# EAGLE design HW2_latest (EAGLE 7.5.0)
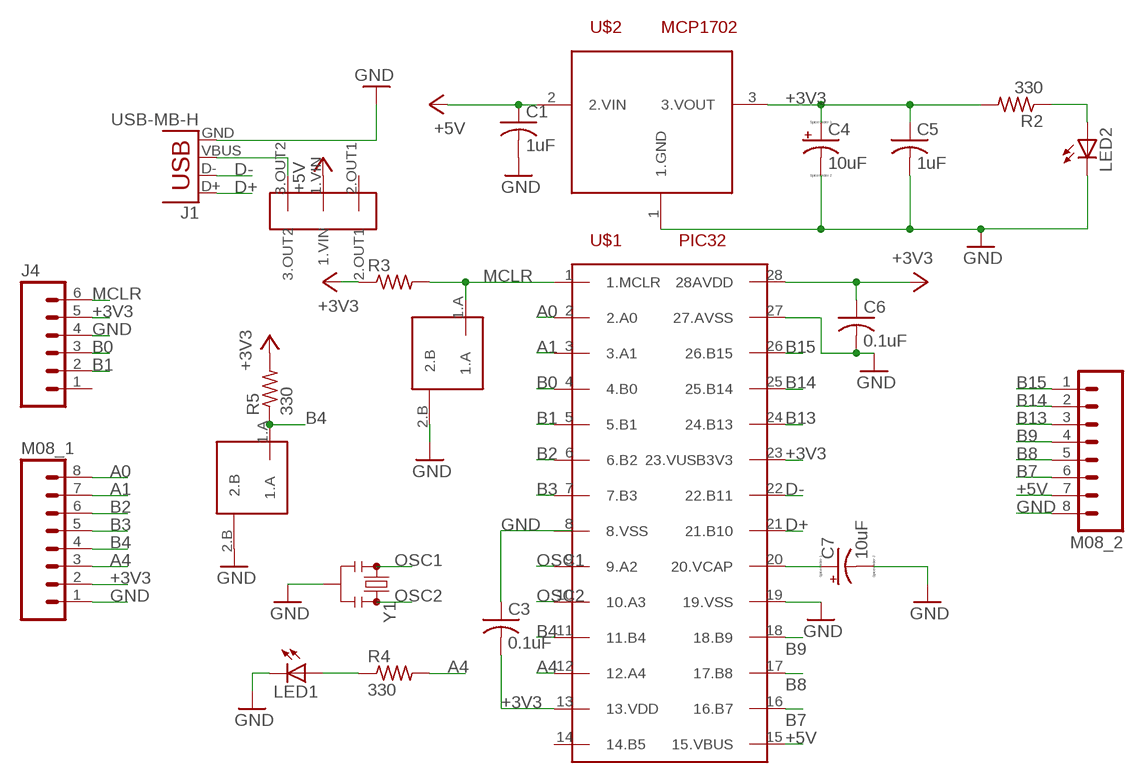
[diagram p0: schematic, sheet 1]

## Parts
C1  1uF  C-US025-024X044  [C025-024X044]
C3  0.1uF  C-US025-024X044  [C025-024X044]
C4  10uF  CPOL-USTT2D4  [TT2D4]
C5  1uF  C-US025-024X044  [C025-024X044]
C6  0.1uF  C-US025-024X044  [C025-024X044]
C7  10uF  CPOL-USTT2D4  [TT2D4]
J1  USB-MB-H  [USB-MB-H]
J4  M06SILK_FEMALE_PTH  [1X06]
LED1  LED3MM  [LED3MM]
LED2  LED3MM  [LED3MM]
M08_1  M08  [1X08_ROUND]
M08_2  M08  [1X08_ROUND]
R2  330  R-US_0207/10  [0207/10]
R3  R-US_0207/10  [0207/10]
R4  330  R-US_0207/10  [0207/10]
R5  330  R-US_0207/10  [0207/10]
U$1  PIC32  [DIL28-3]
U$2  MCP1702  [TO92]
U$3  SLIDE_SWITCH  [SLIDE_SWITCH]
U$4  PUSH_BUTTON  [PUSH_BUTTON]
U$5  PUSH_BUTTON  [PUSH_BUTTON]
Y1  RESONATORPTH  [RESONATOR-PTH]

## Nets
+3V3: C3.2 C4.+ C5.1 C6.1 J4.5 M08_1.2 R2.2 R3.1 R5.2 U$1.13(13.VDD) U$1.23(23.VUSB3V3) U$1.28(28AVDD) U$2.3(3.VOUT)
+5V: C1.1 M08_2.7 U$1.15(15.VBUS) U$2.2(2.VIN) U$3.1.VIN
A0: M08_1.8 U$1.2(2.A0)
A1: M08_1.7 U$1.3(3.A1)
A4: M08_1.3 R4.2 U$1.12(12.A4)
B0: J4.3 U$1.4(4.B0)
B1: J4.2 U$1.5(5.B1)
B2: M08_1.6 U$1.6(6.B2)
B3: M08_1.5 U$1.7(7.B3)
B4: M08_1.4 R5.1 U$1.11(11.B4) U$5.1.A
B7: M08_2.6 U$1.16(16.B7)
B8: M08_2.5 U$1.17(17.B8)
B9: M08_2.4 U$1.18(18.B9)
B13: M08_2.3 U$1.24(24.B13)
B14: M08_2.2 U$1.25(25.B14)
B15: M08_2.1 U$1.26(26.B15)
D+: J1.D+ U$1.21(21.B10)
D-: J1.D- U$1.22(22.B11)
GND: C1.2 C3.1 C4.- C5.2 C6.2 C7.- J1.GND J4.4 LED1.K(C) LED2.K(C) M08_1.1 M08_2.8 U$1.19(19.VSS) U$1.27(27.AVSS) U$2.1(1.GND) U$4.2.B U$5.2.B Y1.2
MCLR: J4.6 R3.2 U$1.1(1.MCLR) U$4.1.A
N$1: LED1.A R4.1
N$2: LED2.A R2.1
N$3: J1.VBUS U$3.3.OUT2
N$4: C7.+ U$1.20(20.VCAP)
OSC1: U$1.9(9.A2) Y1.1
OSC2: U$1.10(10.A3) Y1.3
Unconnected: J4.1 U$1.8(8.VSS) U$1.14(14.B5) U$3.2.OUT1

## Library data of the parts
C1 C3 C5 C6 = PIC32:C-US: CAPACITOR, American symbol
C4 C7 = PIC32:CPOL-US: POLARIZED CAPACITOR, American symbol
J1 = PIC32:USB: USB Connectors USB-B-PTH is fully proven SKU : PRT-00139/CONN-08278 USB-miniB is fully proven SKU : PRT-00587 USB-A-PCB is untested. USB-A-H is throughly reviewed, but untested. Spark Fun Electronics SKU : PRT-00437 USB-B-SMT is throughly reviewed, but untested. Needs silkscreen touching up. USB-A-S has not been used/tested USB-MB-H has not been used/tested USB-MICROB has been used. CONN-09505
J4 = PIC32:M06: Header 6 Standard 6-pin 0.1" header. Use with straight break away headers (SKU : PRT-00116), right angle break away headers (PRT-00553), swiss pins (PRT-00743), machine pins (PRT-00117), and female headers (PRT-00115). Molex polarized connector foot print use with SKU : PRT-08094 with associated crimp pins and housings. NOTES ON THE VARIANTS LOCK and LOCK_LONGPADS... This footprint was designed to help hold the alignment of a through-hole component (i.e. 6-pin header) while soldering it into place. You may notice that each hole has been shifted either up or down by 0.005 of an inch from it's more standard position (which is a perfectly straight line). This slight alteration caused the pins (the squares in the middle) to touch the edges of the holes. Because they are alternating, it causes a "brace" to hold the component in place. 0.005 has proven to be the perfect amount of "off-center" position when using our standard breakaway headers. Although looks a little odd when you look at the bare footprint, once you have a header in there, the alteration is very hard to notice. Also,if you push a header all the way into place, it is covered up entirely on the bottom side. This idea of altering the position of holes to aid alignment will be further integrated into the Sparkfun Library for other footprints. It can help hold any component with 3 or more connection pins.; PROD_ID: CONN-08437
LED1 LED2 = PIC32:LED: LED OSRAM: - CHIPLED LG R971, LG N971, LY N971, LG Q971, LY Q971, LO R971, LY R971 LH N974, LH R974 LS Q976, LO Q976, LY Q976 LO Q996 - Hyper CHIPLED LW Q18S LB Q993, LB Q99A, LB R99A - SideLED LS A670, LO A670, LY A670, LG A670, LP A670 LB A673, LV A673, LT A673, LW A673 LH A674 LY A675 LS A676, LA A676, LO A676, LY A676, LW A676 LS A679, LY A679, LG A679 - Hyper Micro SIDELED® LS Y876, LA Y876, LO Y876, LY Y876 LT Y87S - SmartLED LW L88C, LW L88S LB L89C, LB L89S, LG L890 LS L89K, LO L89K, LY L89K LS L896, LA L896, LO L896, LY L896 - TOPLED LS T670, LO T670, LY T670, LG T670, LP T670 LSG T670, LSP T670, LSY T670, LOP T670, LYG T670 LG T671, LOG T671, LSG T671 LB T673, LV T673, LT T673, LW T673 LH T674 LS T676, LA T676, LO T676, LY T676, LB T676, LH T676, LSB T676, LW T676 LB T67C, LV T67C, LT T67C, LS T67K, LO T67K, LY T67K, LW E67C LS E67B, LA E67B, LO E67B, LY E67B, LB E67C, LV E67C, LT E67C LW T67C LS T679, LY T679, LG T679 LS T770, LO T770, LY T770, LG T770, LP T770 LB T773, LV T773, LT T773, LW T773 LH T774 LS E675, LA E675, LY E675, LS T675 LS T776, LA T776, LO T776, LY T776, LB T776 LHGB T686 LT T68C, LB T68C - Hyper Mini TOPLED® LB M676 - Mini TOPLED Santana® LG M470 LS M47K, LO M47K, LY M47K Source: http://www.osram.convergy.de LUXEON: - LUMILED® LXK2-PW12-R00, LXK2-PW12-S00, LXK2-PW14-U00, LXK2-PW14-V00 LXK2-PM12-R00, LXK2-PM12-S00, LXK2-PM14-U00 LXK2-PE12-Q00, LXK2-PE12-R00, LXK2-PE12-S00, LXK2-PE14-T00, LXK2-PE14-U00 LXK2-PB12-K00, LXK2-PB12-L00, LXK2-PB12-M00, LXK2-PB14-N00, LXK2-PB14-P00, LXK2-PB14-Q00 LXK2-PR12-L00, LXK2-PR12-M00, LXK2-PR14-Q00, LXK2-PR14-R00 LXK2-PD12-Q00, LXK2-PD12-R00, LXK2-PD12-S00 LXK2-PH12-R00, LXK2-PH12-S00 LXK2-PL12-P00, LXK2-PL12-Q00, LXK2-PL12-R00 Source: www.luxeon.com KINGBRIGHT: KA-3528ASYC Source: www.kingbright.com
M08_1 M08_2 = PIC32:M08: Header 8 Standard 8-pin 0.1" header. Use with straight break away headers (SKU : PRT-00116), right angle break away headers (PRT-00553), swiss pins (PRT-00743), machine pins (PRT-00117), and female headers (PRT-00115).; PROD_ID: CONN-08437
R2-R5 = PIC32:R-US_: RESISTOR, American symbol
U$1 = PIC32:PIC32
U$2 = PIC32:MCP1702
U$3 = PIC32:SLIDE_SWITCH
U$4 U$5 = PIC32:PUSH_BUTTON
Y1 = PIC32:RESONATOR: Resonator Small SMD resonator. Used, eg, on the Arduino Pro/ Pro Mini boards. 8MHz- XTAL-08895 16MHz- XTAL-08900

## Board
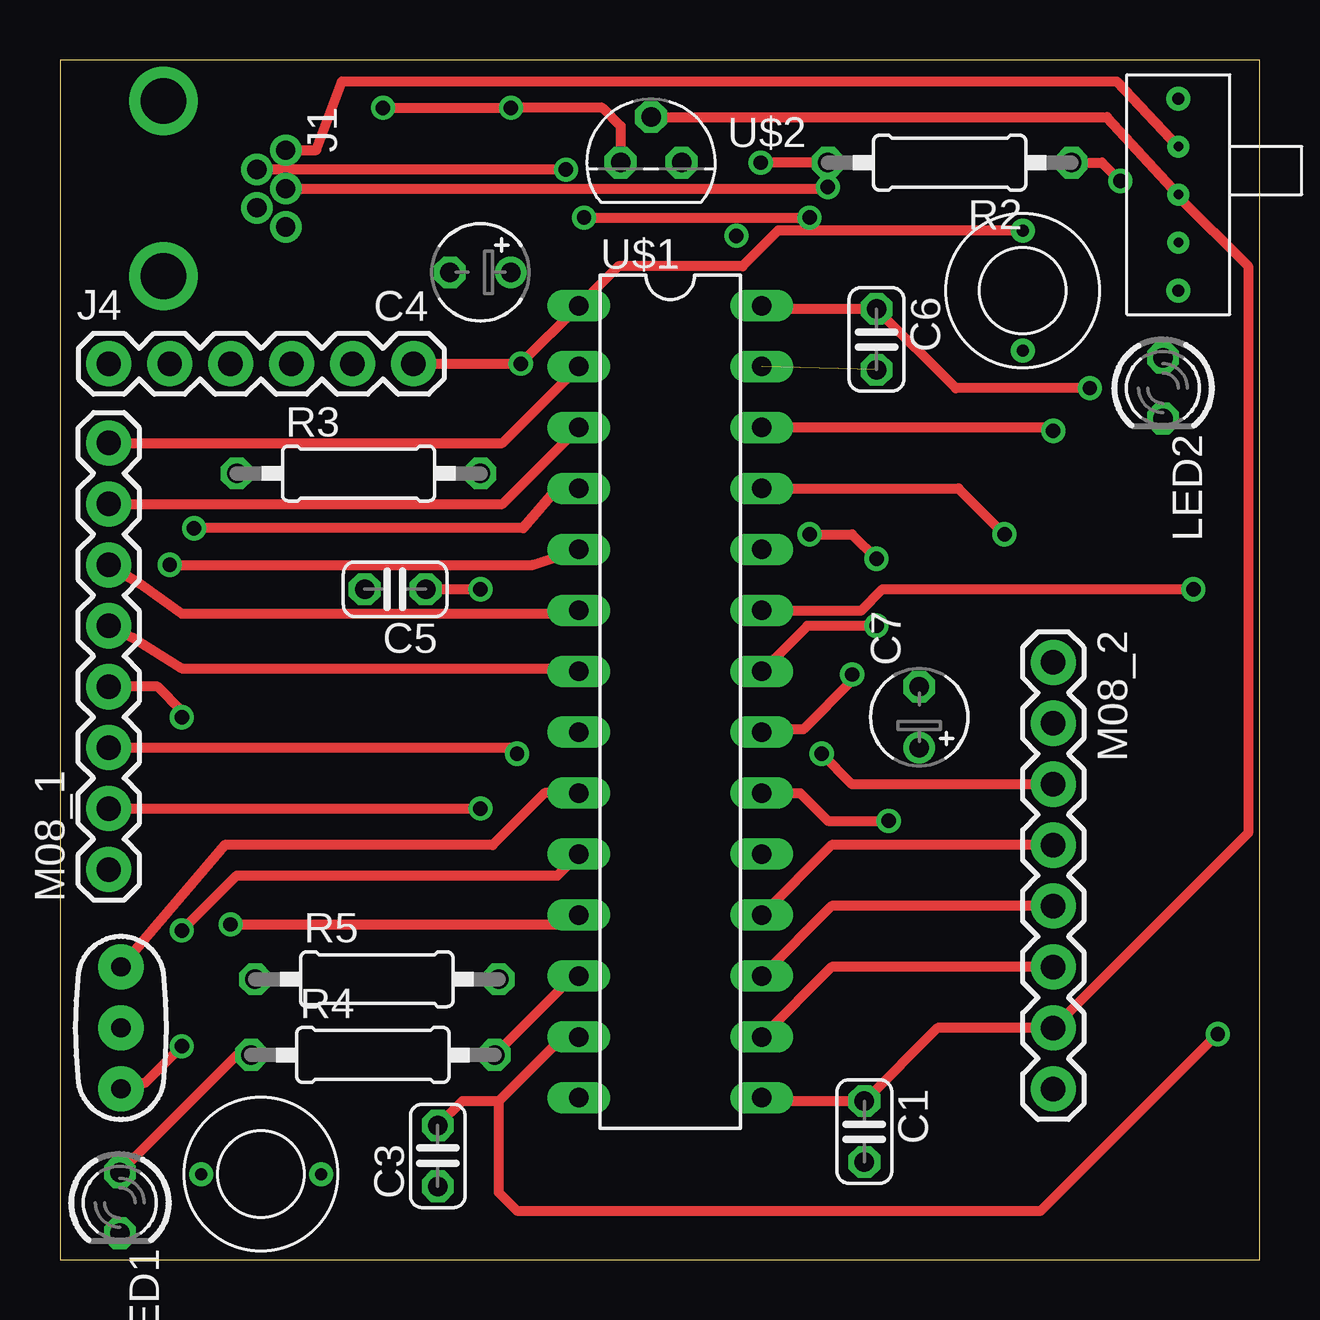
[diagram p1: board, top side]
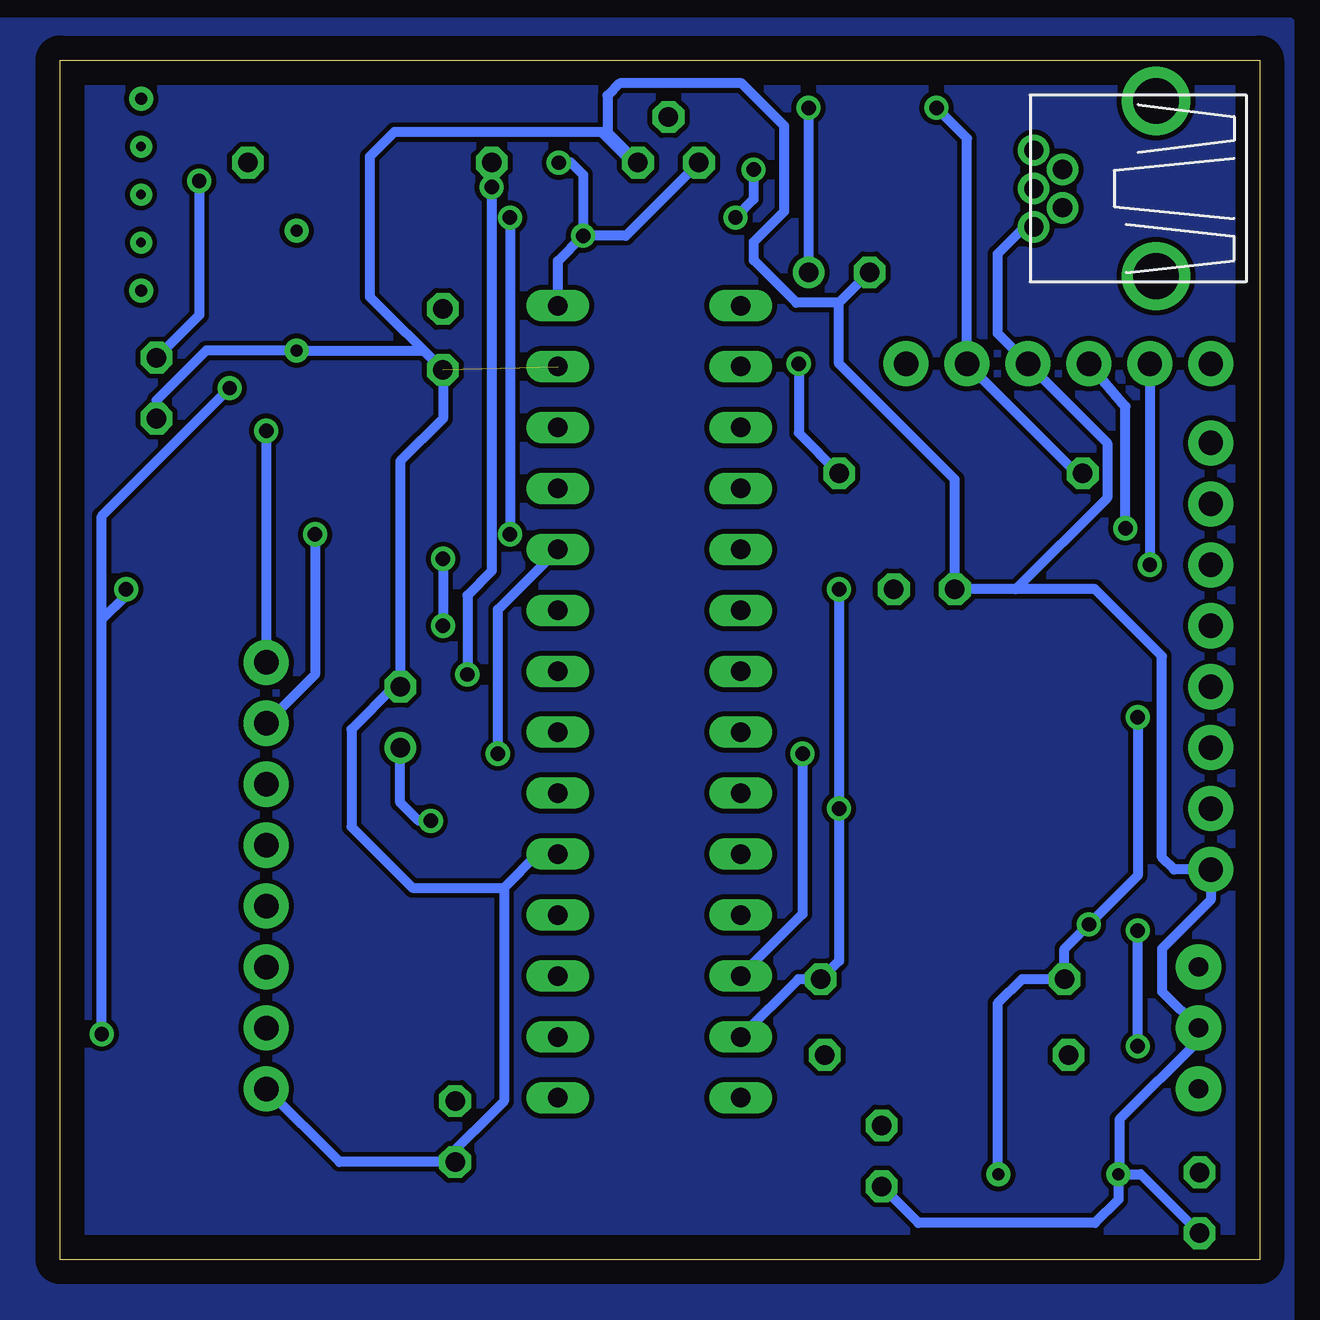
[diagram p2: board, bottom side, seen from below]

Size 50 x 50 mm. Coordinates in mm from the lower left corner, seen from the top.
Outline: 0,0 50,0 50,50 0,50 0,0
Copper layers (1*16): Top 0.035mm / dielectric 1.5mm / Bottom 0.035mm
Design rules "default": minimum track width 10mil, minimum drill 24mil, track to track 8mil, track to pad 8mil, pad to pad 8mil, via to via 8mil, smd to smd 8mil, copper to edge 40mil, drill to drill 8mil, minimum pad ring 10mil, minimum via ring 8mil, stop-mask expansion 4mil, vias tented up to drill 0mil, thermal gap 10mil

### Footprints (pad centres in the part's own frame; a part is rotated, then mirrored left to right if it is on the bottom)
C025-024X044 = drill 0.813 octagon: 1 -1.27,0; 2 1.27,0
TT2D4 = drill 0.813: + -1.27,0 | drill 0.813 octagon: - 1.27,0
USB-MB-H = drill 0.8: D+ 5.1,0; D- 3.9,0.8; GND 5.1,-1.6; ID 3.9,-0.8; VBUS 5.1,1.6 | drill 1.9: P$6 0,-3.65; P$7 0,3.65
1X06 = drill 1.016 pad 1.88: 1 0,0; 2 2.54,0; 3 5.08,0; 4 7.62,0; 5 10.16,0; 6 12.7,0
LED3MM = drill 0.813 octagon: A -1.27,0; K 1.27,0
1X08_ROUND = drill 1.016 pad 1.88: 1 0,0; 2 2.54,0; 3 5.08,0; 4 7.62,0; 5 10.16,0; 6 12.7,0; 7 15.24,0; 8 17.78,0
0207/10 = drill 0.813 octagon: 1 -5.08,0; 2 5.08,0
DIL28-3 = drill 0.813 long: 1 -16.51,-3.81; 2 -13.97,-3.81; 3 -11.43,-3.81; 4 -8.89,-3.81; 5 -6.35,-3.81; 6 -3.81,-3.81; 7 -1.27,-3.81; 8 1.27,-3.81; 9 3.81,-3.81; 10 6.35,-3.81; 11 8.89,-3.81; 12 11.43,-3.81; 13 13.97,-3.81; 14 16.51,-3.81; 15 16.51,3.81; 16 13.97,3.81; 17 11.43,3.81; 18 8.89,3.81; 19 6.35,3.81; 20 3.81,3.81; 21 1.27,3.81; 22 -1.27,3.81; 23 -3.81,3.81; 24 -6.35,3.81; 25 -8.89,3.81; 26 -11.43,3.81; 27 -13.97,3.81; 28 -16.51,3.81
TO92 = drill 0.813 octagon: 1 1.27,0; 2 0,1.905; 3 -1.27,0
SLIDE_SWITCH = drill 0.4: 1.VIN 0,0; 2.OUT1 -2,0; 3.OUT2 2,0 | drill 0.5: 4.X -4,0; 5.X 4,0
PUSH_BUTTON = drill 0.5: 1.A -2.5,0; 2.B 2.5,0
RESONATOR-PTH = drill 0.8 pad 1.88: 1 -2.54,0; 2 0,0; 3 2.54,0

### Placement (x,y rotation side)
C1  33.53,5.33 270 top
C3  15.75,4.32 90 top
C4  17.53,41.15 180 top
C5  13.97,27.94 180 top
C6  34.04,38.35 270 top
C7  35.81,22.61 90 top
J1  4.31,44.64 0 top
J4  2.03,37.34 0 top
LED1  2.49,2.36 270 top
LED2  45.97,36.32 270 top
M08_1  2.03,16.26 90 top
M08_2  41.4,24.89 270 top
R2  37.08,45.72 180 top
R3  12.45,32.77 0 top
R4  13.04,8.53 0 top
R5  13.21,11.68 0 top
U$1  25.44,23.25 270 top
U$2  24.64,45.72 0 top
U$3  46.62,44.39 90 top
U$4  40.13,40.39 270 top
U$5  8.38,3.56 180 top
Y1  2.54,9.65 270 top

### Tracks (layer width: path | path; a pad name or v marks a point on that pad's centre or on a via)
+3V3  (via drill 0.6)
  Top 0.406: U$1.28 29.39,39.62 C6.1 37.34,36.32 v42.93,36.32 | R2.2 v29.21,45.72 | v13.46,48.01 v18.8,48.01 22.61,48.01 23.37,47.24 U$2.3 | U$1.13 20.96,9.28 18.29,6.6 | 18.29,6.6 18.29,2.79 19.05,2.03 40.89,2.03 v48.26,9.4 | 18.29,6.6 16.76,6.6 C3.2 | 4.06,18.8 M08_1.2 v17.53,18.8 | C5.1 v17.53,27.94 | U$1.23 33.41,27.06 34.29,27.94 v47.24,27.94
  Bottom 0.406: U$1.28 29.25,41.62 v28.19,42.67 | v29.21,45.72 28.7,45.72 28.19,45.21 v28.19,42.67 | v13.46,48.01 12.19,46.74 J4.5 7.62,32.77 R3.1 | v48.26,9.4 48.26,26.67 | 48.26,26.67 48.26,30.99 v42.93,36.32 | U$1.13 19.23,11.68 R5.2 17.53,12.45 v17.53,18.8 v17.53,27.94 | v18.8,48.01 C4.+ | U$2.3 26.42,42.67 v28.19,42.67 | v47.24,27.94 47.24,27.69 48.26,26.67
+5V
  Top 0.406: U$2.2 43.64,47.62 U$3.1.VIN 46.62,44.31 49.53,41.4 49.53,17.78 M08_2.7 36.58,9.65 C1.1 29.39,6.6 U$1.15
A0
  Top 0.406: M08_1.8 18.45,34.04 U$1.2
A1
  Top 0.406: M08_1.7 18.45,31.5 U$1.3
A4  (via drill 0.6)
  Top 0.406: U$1.12 21.41,11.82 R4.2 | M08_1.3 18.8,21.34 v19.05,21.08
  Bottom 0.406: v19.05,21.08 19.05,14.4 U$1.12
B0  (via drill 0.6)
  Top 0.406: U$1.4 20.71,32.14 19.3,30.48 v5.59,30.48
  Bottom 0.406: v5.59,30.48 5.59,35.56 J4.3
B1  (via drill 0.6)
  Top 0.406: v4.57,28.96 19.72,28.96 U$1.5
  Bottom 0.406: J4.2 v4.57,28.96
B2
  Top 0.406: M08_1.6 3.3,28.19 5.08,26.92 21.49,26.92 U$1.6
B3
  Top 0.406: M08_1.5 3.05,25.91 5.08,24.64 21.51,24.64 U$1.7
B4  (via drill 0.6)
  Top 0.406: v7.11,13.97 21.24,13.97 U$1.11 | v5.08,22.61 5.08,22.86 4.06,23.88 M08_1.4
  Bottom 0.406: v5.08,22.61 5.08,16 v7.11,13.97 8.13,12.95 R5.1 9.91,11.68 10.92,10.67 10.92,3.6 U$5.1.A
B7
  Top 0.406: M08_2.6 32.16,12.19 U$1.16
B8
  Top 0.406: M08_2.5 32.16,14.73 U$1.17
B9
  Top 0.406: M08_2.4 32.16,17.27 U$1.18
B13  (via drill 0.6)
  Top 0.406: M08_2.3 33.02,19.81 v31.75,21.08
  Bottom 0.406: v31.75,21.08 31.75,27.1 U$1.24
B14  (via drill 0.6)
  Top 0.406: U$1.25 37.46,32.14 v39.37,30.23
  Bottom 0.406: v39.37,30.23 39.37,24.38 M08_2.2
B15  (via drill 0.6)
  Top 0.406: v41.4,34.54 41.27,34.68 U$1.26
  Bottom 0.406: v41.4,34.54 M08_2.1
D+  (via drill 0.6)
  Top 0.406: J1.D+ 31.94,44.64 v32,44.7 | v33.02,24.38 33.02,24.13 30.99,22.1 29.37,22.1 U$1.21
  Bottom 0.406: v32,44.7 32,28.7 33.02,27.69 v33.02,24.38
D-  (via drill 0.6)
  Top 0.406: J1.D- v21.08,45.44 v21.09,45.43 | v21.84,43.43 v31.24,43.43 | v31.24,30.23 33.02,30.23 v34.04,29.21 | v34.04,26.42 31.15,26.42 U$1.22
  Bottom 0.406: v21.09,45.43 21.09,44.19 v21.84,43.43 | v31.24,43.43 v31.24,30.23 | v34.04,29.21 v34.04,26.42
GND  (1 unrouted)
  Bottom 0.406: U$5.2.B 5.84,3.6 5.84,5.84 2.54,9.14 Y1.2 4.06,11.18 4.06,12.95 2.03,14.99 M08_1.1 3.56,16.26 4.06,16.76 4.06,25.15 6.86,27.94 10.16,27.94 | U$5.2.B 4.96,3.56 LED1.K | U$5.2.B 5.88,2.5 6.86,1.52 14.22,1.52 C3.1 | 10.16,27.94 C5.2 12.7,32.51 17.53,37.34 17.53,39.88 | 17.53,39.88 C4.- | J1.GND 9.79,43.04 10.92,41.91 10.92,38.61 J4.4 6.35,34.04 6.35,31.75 10.16,27.94 | 17.53,39.88 19.3,39.88 21.08,41.66 21.08,42.42 19.81,43.69 19.81,47.24 21.59,49.02 26.67,49.02 27.18,48.51 27.18,46.99 U$2.1 26.16,45.72 27.43,46.99 36.07,46.99 37.08,45.97 37.08,40.13 C6.2 | C1.2 34.04,4.06 | 34.04,4.06 38.35,4.06 M08_2.8 | U$1.19 30.09,16.9 31.5,15.49 | 31.5,15.49 31.5,6.6 34.04,4.06 | 31.5,15.49 35.31,15.49 37.85,18.03 37.85,22.1 36.07,23.88 C7.- 35.81,33.27 34.04,35.05 C6.2 | LED2.K 45.97,35.81 43.9,37.89 U$4.2.B 34.84,37.89 C6.2
MCLR  (via drill 0.6)
  Top 0.406: J4.6 v19.21,37.34 U$1.1 23.27,41.4 28.45,41.4 29.93,42.89 U$4.1.A
  Bottom 0.406: v19.21,37.34 19.21,34.45 R3.2
N$1
  Top 0.406: R4.1 7.39,8.53 LED1.A
N$2  (via drill 0.6)
  Top 0.406: R2.1 43.43,45.72 v44.2,44.96
  Bottom 0.406: v44.2,44.96 44.2,39.37 LED2.A
N$3
  Top 0.406: J1.VBUS 10.68,46.24 11.76,49.11 44.04,49.11 U$3.3.OUT2
N$4  (via drill 0.6)
  Top 0.406: U$1.20 30.85,19.44 32,18.29 v34.54,18.29
  Bottom 0.406: v34.54,18.29 35.05,18.29 35.81,19.05 C7.+
N$5
  pour Bottom: -1.27,51.56 53.09,51.56 53.09,-5.08 -1.27,-5.08
OSC1
  Top 0.406: U$1.9 20.2,19.44 18.03,17.27 6.86,17.27 Y1.1
OSC2  (via drill 0.6)
  Top 0.406: Y1.3 2.54,7.62 2.79,7.37 3.56,7.37 v5.08,8.89 | v5.08,13.72 7.37,16 20.73,16 U$1.10
  Bottom 0.406: v5.08,8.89 v5.08,13.72